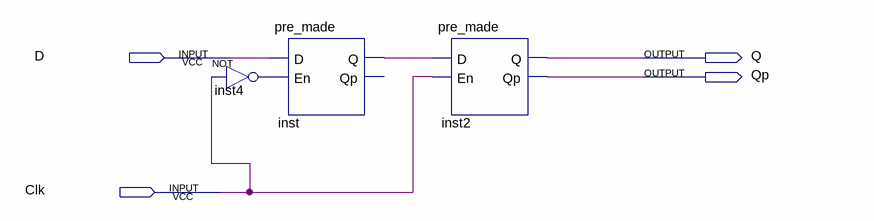
[diagram p0: schematic sheet]
// Quartus schematic EdgeD.bdf as structural Verilog: 3 symbols, 4 pins
module EdgeD (
  input  D,
  input  Clk,
  output Q,
  output Qp
);

  wire inst4_out, inst_q;

  not inst4 (inst4_out, Clk);
  pre_made inst (.D(D), .En(inst4_out), .Q(inst_q));  // open: Qp
  pre_made inst2 (.D(inst_q), .En(Clk), .Q(Q), .Qp(Qp));
endmodule
